# Altium schematic sheet Power_Delivery.SchDoc: Calimotion 7.0
size A4; Date: 2024-06-17; Author: Marc-Olivier Beaulieu; CompanyName: Calimacil Inc.; DrawnBy: Marc-Olivier Beaulieu; Engineer: Marc-Olivier Beaulieu; Organization: Calimotion; Revision: 1.0; SheetNumber: 2; SheetTotal: 2; Time: 15:30
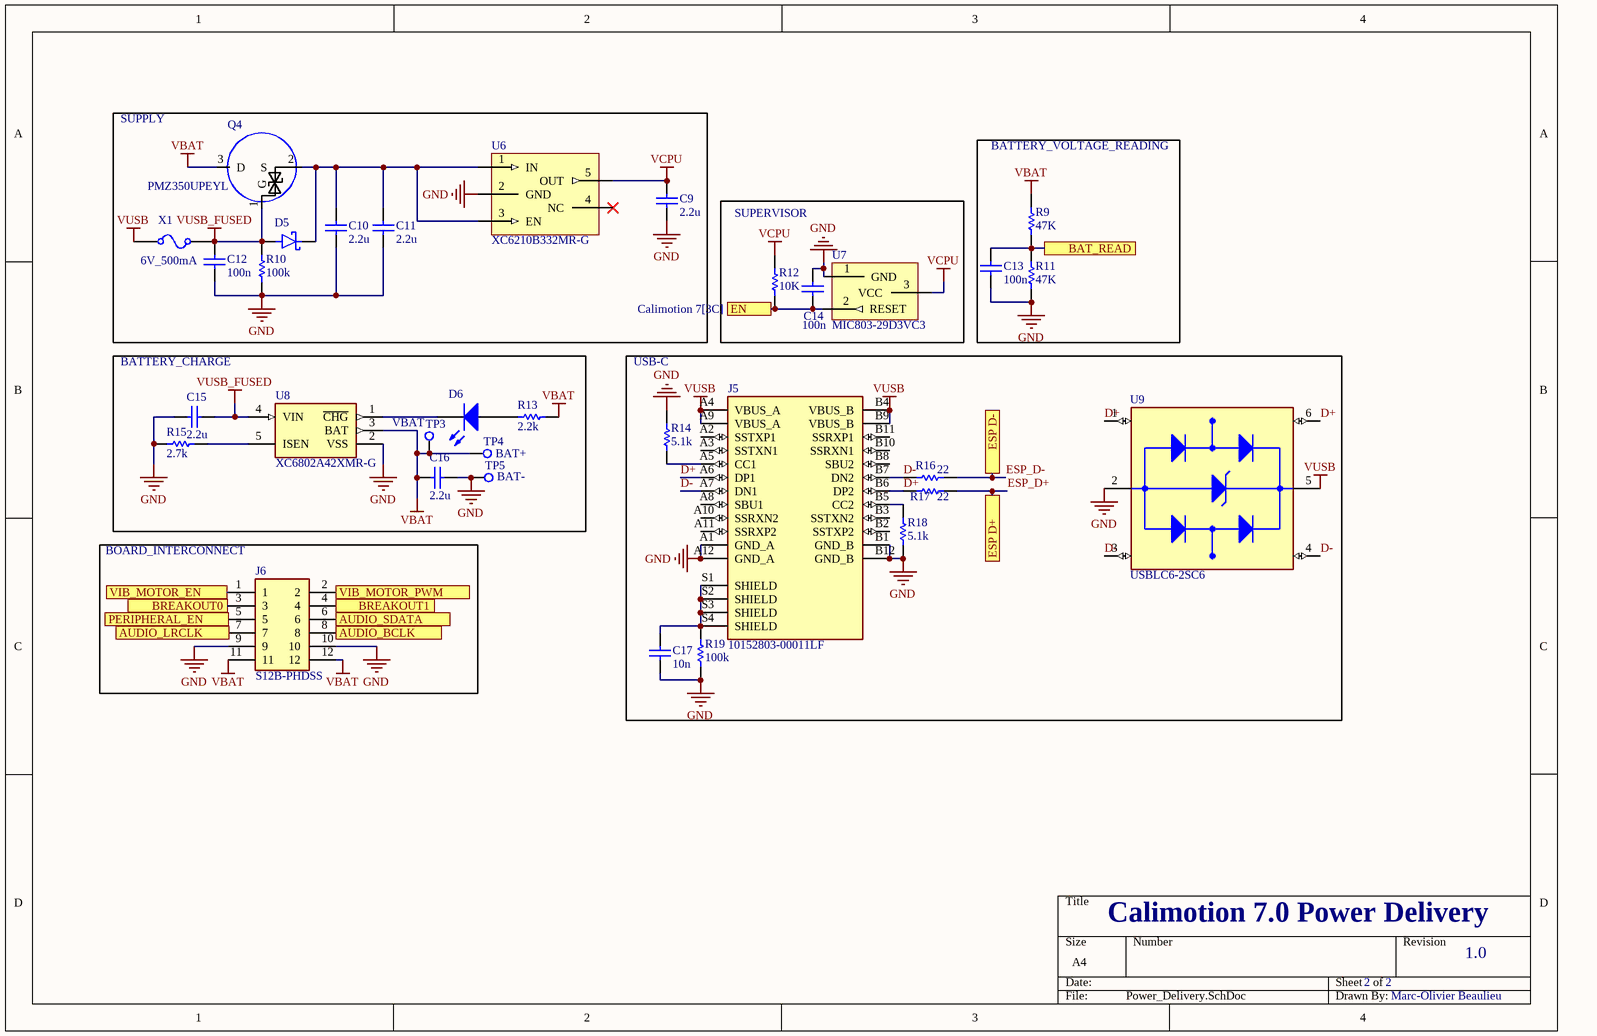
[diagram p0: Power_Delivery.SchDoc]

## Parts
C9  value 2.2u  [CAP 0402_1005]  (hidden comment: Capacitor)
C10  value 2.2u  [CAP 0402_1005]  (hidden comment: Capacitor)
C11  value 2.2u  [CAP 0402_1005]  (hidden comment: Capacitor)
C12  value 100n  [CAP 0402_1005]  (hidden comment: Capacitor)
C13  value 100n  [CAP 0402_1005]  (hidden comment: Capacitor)
C14  value 100n  [CAP 0402_1005]  (hidden comment: Capacitor)
C15  value 2.2u  [CAP 0402_1005]  (hidden comment: Capacitor)
C16  value 2.2u  [CAP 0402_1005]  (hidden comment: Capacitor)
C17  value 10n  [CAP 0402_1005]  (hidden comment: Capacitor)
D5  SHOTTKY  [SOD-923]  (value not drawn)
D6  Light-Emitting Diode  [LEDSC160X80X70L45N]  (value not drawn)
J5  10152803-00011LF  [AMPHENOL_10152803-00011LF]
J6  S12B-PHDSS  [JST_S12B-PHDSS]
Q4  PMZ350UPEYL  [SOT-883]
R9  value 47K  [RES 0402_1005 RF]  (hidden comment: Resistor)
R10  value 100k  [RES 0402_1005 RF]  (hidden comment: Resistor)
R11  value 47K  [RES 0402_1005 RF]  (hidden comment: Resistor)
R12  value 10K  [RES 0402_1005 RF]  (hidden comment: Resistor)
R13  value 2.2k  [RES 0402_1005 RF]  (hidden comment: Resistor)
R14  value 5.1k  [RES 0402_1005 RF]  (hidden comment: Resistor)
R15  value 2.7k  [RES 0402_1005 RF]  (hidden comment: Resistor)
R16  value 22  [RES 0402_1005 RF]  (hidden comment: Resistor)
R17  value 22  [RES 0402_1005 RF]  (hidden comment: Resistor)
R18  value 5.1k  [RES 0402_1005 RF]  (hidden comment: Resistor)
R19  value 100k  [RES 0402_1005 RF]  (hidden comment: Resistor)
TP3  VBAT  [THT-Test_Point]
TP4  BAT+  [THT-Test_Point]
TP5  BAT-  [THT-Test_Point]
U6  XC6210B332MR-G  [SOT-25]
U7  MIC803-29D3VC3  [MIC803-29D3VC3]
U8  XC6802A42XMR-G  [SOT-25]
U9  USBLC6-2SC6  [SOT95P280X145-6N]
X1  CURRENT: 6V_500mA  [RES 0402_1005 RF]  (hidden comment: Fuse)

## Blocks framed on the sheet
SUPPLY: C9-C12 D5 Q4 R10 U6 X1
BATTERY_VOLTAGE_READING: C13 R9 R11
SUPERVISOR: C14 R12 U7
BATTERY_CHARGE: C15 C16 D6 R13 R15 TP3-TP5 U8
USB-C: C17 J5 R14 R16-R19 U9
BOARD_INTERCONNECT: J6

## Ports
AUDIO_BCLK (see Calimotion 7[3C]), AUDIO_LRCLK (see Calimotion 7[3C]), AUDIO_SDATA (see Calimotion 7[3C]), BAT_READ (see Calimotion 7[2D]), BREAKOUT0 (see Calimotion 7[2D]), BREAKOUT1 (see Calimotion 7[2D]), EN (see Calimotion 7[3C]), ESP D+ (see Calimotion 7[3D]), ESP D- (see Calimotion 7[3D]), PERIPHERAL_EN (see Calimotion 7[1A], Calimotion 7[2C]), VIB_MOTOR_EN (see Calimotion 7[2D]), VIB_MOTOR_PWM (see Calimotion 7[2D])

## Nets
GND: C9.1 C10.2 C11.2 C12.1 C13.2 C14.1 C15.2 C16.1 C17.2 J5.A1(GND_A) J5.A12(GND_A) J5.B1(GND_B) J5.B12(GND_B) J6.9 J6.10 R10.2 R11.2 R14.2 R15.2 R18.1 R19.2 TP5.1(TP) U6.2(GND) U7.1(GND) U8.2(VSS) U9.2(GND)
VBAT: C16.2 J6.11 J6.12 Q4.3(D) R9.1 R13.1 TP3.1(TP) TP4.1(TP) U8.3(BAT)
VCPU: C9.2 R12.2 U6.5(OUT) U7.3(VCC)
VUSB: J5.A4(VBUS_A) J5.A9(VBUS_A) J5.B4(VBUS_B) J5.B9(VBUS_B) U9.5(VBUS) X1.1
VUSB_FUSED: C12.2 C15.1 D5.A Q4.1(G) R10.1 U8.4(VIN) X1.2
AUDIO_BCLK: J6.8 ; port AUDIO_BCLK
AUDIO_LRCLK: J6.7 ; port AUDIO_LRCLK
AUDIO_SDATA: J6.6 ; port AUDIO_SDATA
BAT_READ: C13.1 R9.2 R11.1 ; port BAT_READ
BREAKOUT0: J6.3 ; port BREAKOUT0
BREAKOUT1: J6.4 ; port BREAKOUT1
D+: J5.A6(DP1) J5.B6(DP2) R17.1 U9.1(I/O1_IN) U9.6(I/O1_OUT)
D-: J5.A7(DN1) J5.B7(DN2) R16.1 U9.3(I/O2_IN) U9.4(I/O2_OUT)
EN: C14.2 R12.1 U7.2(RESET) ; port EN
ESP_D+: R17.2 ; port ESP D+
ESP_D-: R16.2 ; port ESP D-
PERIPHERAL_EN: J6.5 ; port PERIPHERAL_EN
VIB_MOTOR_EN: J6.1 ; port VIB_MOTOR_EN
VIB_MOTOR_PWM: J6.2 ; port VIB_MOTOR_PWM
NetC10_1: C10.1 C11.1 D5.C(K) Q4.2(S) U6.1(IN) U6.3(EN)
NetC17_1: C17.1 J5.S1(SHIELD) J5.S2(SHIELD) J5.S3(SHIELD) J5.S4(SHIELD) R19.1
NetD6_1: D6.1(A) R13.2
NetD6_2: D6.2(K) U8.1(~{CHG})
NetJ5_A5: J5.A5(CC1) R14.1
NetJ5_B5: J5.B5(CC2) R18.2
NetR15_1: R15.1 U8.5(ISEN)

Not connected (* = marked no-connect by the designer): J5 A2(SSTXP1) A3(SSTXN1) A8(SBU1) A10(SSRXN2) A11(SSRXP2) B2(SSTXP2) B3(SSTXN2) B8(SBU2) B10(SSRXN1) B11(SSRXP1); U6 4(NC)*

## Notes on the sheet
- Calimotion 7.0 Power Delivery
- 2
- 1.0
- Marc-Olivier Beaulieu

## Library data of the parts
C9-C17 = Capacitor: SimulationGenericComponent: True
D5 = SHOTTKY: Generic Shottky; MF: ON Semiconductor; MP: ESD9X5.0ST5G; Availability: Unavailable; Value: *; Package: SOD-923 ON Semiconductor; Price: None; SnapEDA_Link: https://www.snapeda.com/parts/ESD9X5.0ST5G/ON%20Semiconductor/view-part/237761/?ref=snap
D6 = LED: AF: 1; BV: 0; BV_MAX: 1e99; EG: 1.11; FC: 0.5; IBV: 0.001; IS: 1e-14; MJSW: 0.33; NTUN: 30; TNOM: 27; XTI: 3; SimulationGenericComponent: True; CJO: 0; CJP: 0; CTA: 0; CTP: 0; FCS: 0.5; FV_MAX: 1e99; IKF: 0; IKR: 0; ISR: 1e-14; JSW: 0; JTUN: 0; JTUNSW: 0; KEG: 1; KF: 0; LEVEL: 1; N: 1; NBV: 1; NR: 1; NS: 1; PHP: 1; RS: 0; TCV: 0; TLEV: 0; TLEVC: 0; TM1: 0; TM2: 0; TPB: 0; TPHP: 0; TRS: 0; TRS2: 0; TT: 0; TTT1: 0; TTT2: 0; VJ: 1; XTITUN: 3
J5 = 10152803-00011LF: USB 3.2 Type C GEN 2 Receptacle SMT Dual Row 24in; MF: Amphenol FCI; Package: None; Price: None; Check_prices: https://www.snapeda.com/parts/10152803-00011LF/Amphenol/view-part/?ref=eda; Value: *; SnapEDA_Link: https://www.snapeda.com/parts/10152803-00011LF/Amphenol/view-part/?ref=snap; MP: 10152803-00011LF; Availability: In Stock; Purchase-URL: https://pricing.snapeda.com/search?q=10152803-00011LF&ref=eda
J6 = S12B-PHDSS: Connector Header Through Hole, Right Angle 12 position 0.079 _2.00mm_; MF: JST Sales; MP: S8B-PHDSS; SnapEDA_Link: https://www.snapeda.com/parts/S8B-PHDSS/JST%20Sales%20America%20Inc./view-part/761599/?ref=snap; Value: *; Price: None; Availability: Unavailable; Package: None
Q4 = PMZ350UPEYL: P-Channel 20 V 1A (Ta) 360mW (Ta), 3.125W (Tc) Surface Mount SOT-883
R9-R19 = Resistor: TC1: 0; SimulationGenericComponent: True; TC2: 0
TP3-TP5 = Test Point
U6 = XC6210B332MR-G: Linear Voltage Regulator IC Positive Fixed 1 Output 700mA SOT-25
U7 = MIC803-29D3VC3: Supervisor Open Drain or Open Collector 1 Channel SC-70-3 Voltage - Threshold 2.93V
U8 = XC6802A42XMR-G: Charger IC Lithium Ion/Polymer SOT-25; MF: Torex; Package: SOT-753 Torex; MP: XC6802A42XMR-G; Value: *; Availability: Unavailable; SnapEDA_Link: https://www.snapeda.com/parts/XC6802A42XMR-G/Torex/view-part/378965/?ref=snap; Price: None
U9 = USBLC6-2SC6: 17V Clamp 5A (8/20Âµs) Ipp Tvs Diode Surface Mount SOT-23-6; MF: STMicroelectronics; Value: *; SnapEDA_Link: https://www.snapeda.com/parts/USBLC6-2SC6/STMicroelectronics/view-part/?ref=snap; Check_prices: https://www.snapeda.com/parts/USBLC6-2SC6/STMicroelectronics/view-part/?ref=eda; Purchase-URL: https://pricing.snapeda.com/search/part/USBLC6-2SC6/?ref=eda; Price: None; Availability: In Stock; Package: SOT-23-6 STMicroelectronics; MP: USBLC6-2SC6
X1 = Fuse: RESISTANCE: 1m; SimulationGenericComponent: True